# EAGLE schematic Dash V2 (EAGLE 6.4)
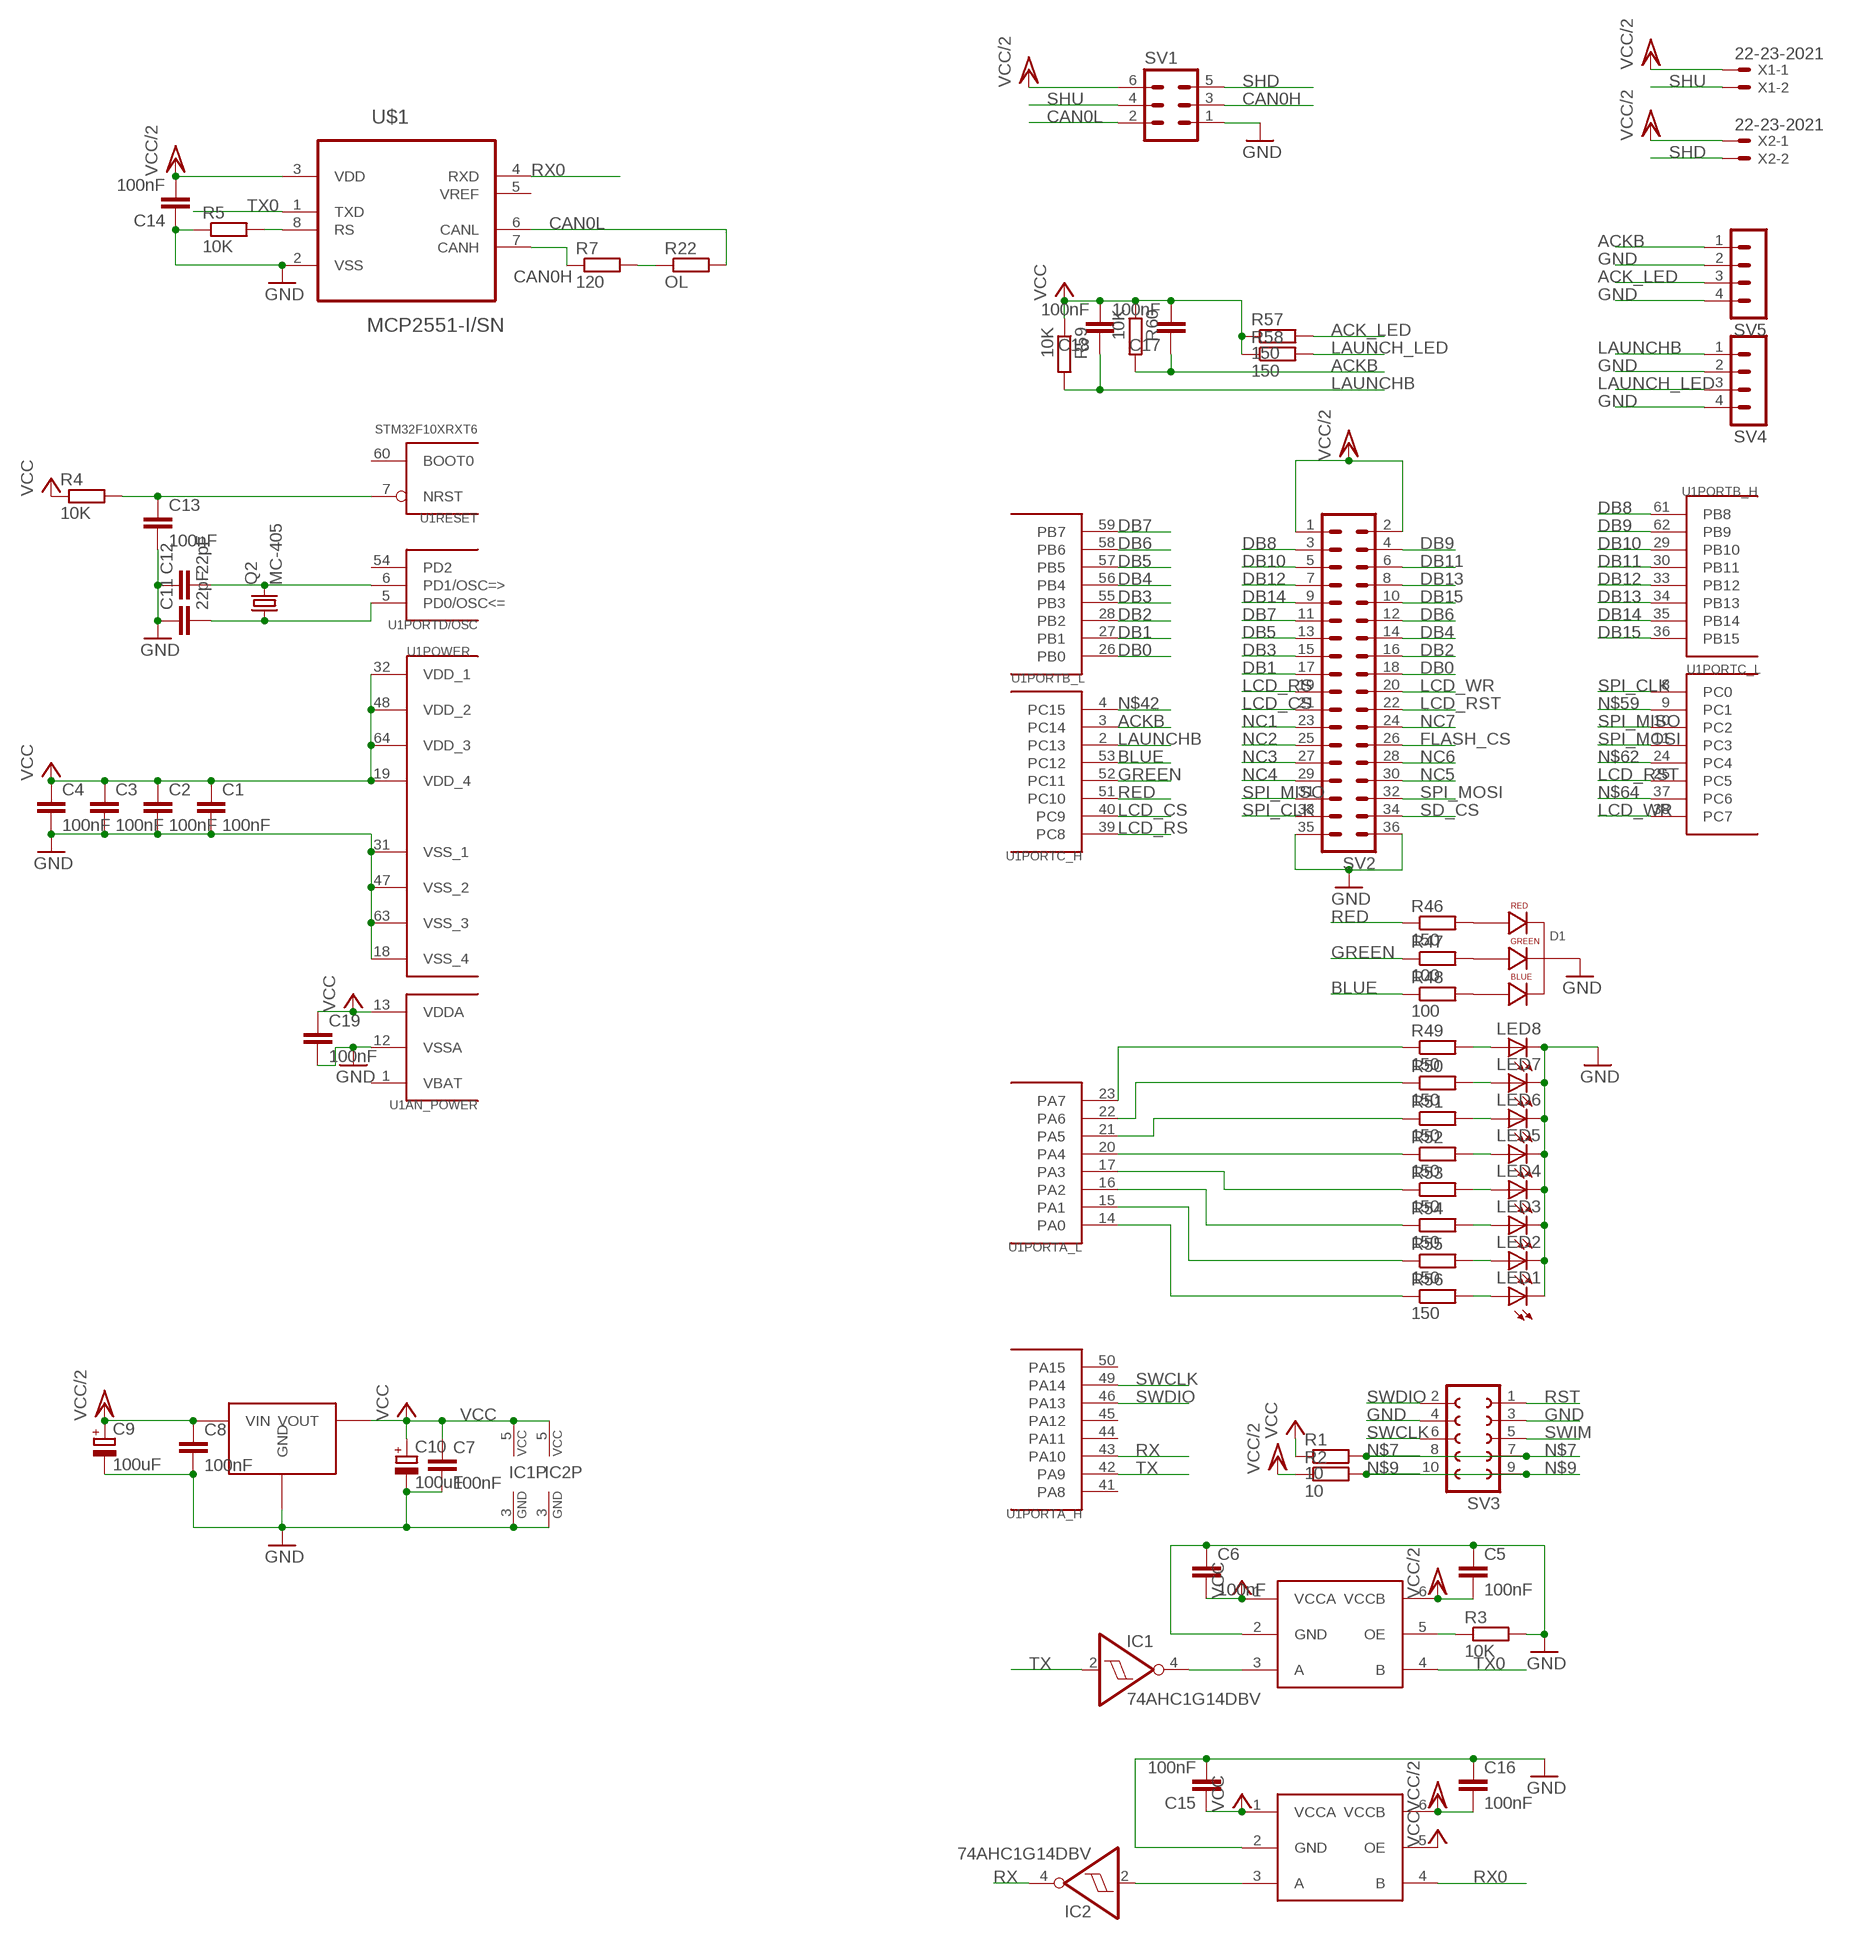
[diagram p0: schematic, sheet 1]

## Parts
C1  100nF  C-EUC0805  [C0805]
C2  100nF  C-EUC0805  [C0805]
C3  100nF  C-EUC0805  [C0805]
C4  100nF  C-EUC0805  [C0805]
C5  100nF  C-EUC0805  [C0805]
C6  100nF  C-EUC0805  [C0805]
C7  100nF  C-EUC0805  [C0805]
C8  100nF  C-EUC0805  [C0805]
C9  100uF  CPOL-EU153CLV-0605  [153CLV-0605]
C10  100uF  CPOL-EU153CLV-0605  [153CLV-0605]
C11  22pF  C-EUC0805  [C0805]
C12  22pF  C-EUC0805  [C0805]
C13  100nF  C-EUC0805  [C0805]
C14  100nF  C-EUC0805  [C0805]
C15  100nF  C-EUC0805  [C0805]
C16  100nF  C-EUC0805  [C0805]
C17  100nF  C-EUC0805  [C0805]
C18  100nF  C-EUC0805  [C0805]
C19  100nF  C-EUC0805  [C0805]
D1  LED-RGB-CC-THRUDIFFUSE  [LED-RGB-THRU]
IC1  74AHC1G14DBV  [SOT23-5]
IC2  74AHC1G14DBV  [SOT23-5]
LED1  LED5MM  [LED5MM]
LED2  LED5MM  [LED5MM]
LED3  LED5MM  [LED5MM]
LED4  LED5MM  [LED5MM]
LED5  LED5MM  [LED5MM]
LED6  LED5MM  [LED5MM]
LED7  LED5MM  [LED5MM]
LED8  LED5MM  [LED5MM]
Q2  MC-405  [MC-405]
R1  10  R-EU_R0805  [R0805]
R2  10  R-EU_R0805  [R0805]
R3  10K  R-EU_R1206  [R1206]
R4  10K  R-EU_R0805  [R0805]
R5  10K  R-EU_R0805  [R0805]
R7  120  R-EU_R0805  [R0805]
R22  OL  R-EU_R0805  [R0805]
R46  150  R-EU_R1206  [R1206]
R47  100  R-EU_R1206  [R1206]
R48  100  R-EU_R1206  [R1206]
R49  150  R-EU_R1206  [R1206]
R50  150  R-EU_R1206  [R1206]
R51  150  R-EU_R1206  [R1206]
R52  150  R-EU_R1206  [R1206]
R53  150  R-EU_R1206  [R1206]
R54  150  R-EU_R1206  [R1206]
R55  150  R-EU_R1206  [R1206]
R56  150  R-EU_R1206  [R1206]
R57  150  R-EU_R1206  [R1206]
R58  150  R-EU_R1206  [R1206]
R59  10K  R-EU_R1206  [R1206]
R60  10K  R-EU_R1206  [R1206]
SV1  MA03-2  [MA03-2]
SV2  MA18-2  [MA18-2]
SV3  FE05-2W  [FE05-2W]
SV4  MA04-1  [MA04-1]
SV5  MA04-1  [MA04-1]
U1  STM32F10XRXT6  [TQFP64]
U$1  MCP2551-I/SN  [SOIC127P600X175-8N]
U$2  TXB0101  [TSOT23-6_DDC]
U$3  TS2940  [TO-252]
U$4  TXB0101  [TSOT23-6_DDC]
X1  22-23-2021  [22-23-2021]
X2  22-23-2021  [22-23-2021]

## Nets
ACK_LED: R57.2 SV5.3
ACKB: C17.1 R60.2 SV5.1 U1.3(PORTC_H:PC14)
BLUE: R48.1 U1.53(PORTC_H:PC12)
CAN0H: R7.1 SV1.3 U$1.7(CANH)
CAN0L: R22.2 SV1.2 U$1.6(CANL)
DB0: SV2.18 U1.26(PORTB_L:PB0)
DB1: SV2.17 U1.27(PORTB_L:PB1)
DB2: SV2.16 U1.28(PORTB_L:PB2)
DB3: SV2.15 U1.55(PORTB_L:PB3)
DB4: SV2.14 U1.56(PORTB_L:PB4)
DB5: SV2.13 U1.57(PORTB_L:PB5)
DB6: SV2.12 U1.58(PORTB_L:PB6)
DB7: SV2.11 U1.59(PORTB_L:PB7)
DB8: SV2.3 U1.61(PORTB_H:PB8)
DB9: SV2.4 U1.62(PORTB_H:PB9)
DB10: SV2.5 U1.29(PORTB_H:PB10)
DB11: SV2.6 U1.30(PORTB_H:PB11)
DB12: SV2.7 U1.33(PORTB_H:PB12)
DB13: SV2.8 U1.34(PORTB_H:PB13)
DB14: SV2.9 U1.35(PORTB_H:PB14)
DB15: SV2.10 U1.36(PORTB_H:PB15)
FLASH_CS: SV2.26
GND: C1.2 C2.2 C3.2 C4.2 C5.1 C6.1 C7.2 C8.2 C9.- C10.- C11.1 C12.1 C13.2 C14.1 C15.2 C16.1 C19.2 D1.2(CATHODE) IC1.3(GND) IC2.3(GND) LED1.K(C) LED2.K(C) LED3.K(C) LED4.K(C) LED5.K(C) LED6.K(C) LED7.K(C) LED8.K(C) R3.2 R5.1 SV1.1 SV2.35 SV2.36 SV3.3 SV3.4 SV4.2 SV4.4 SV5.2 SV5.4 U1.12(AN_POWER:VSSA) U1.18(POWER:VSS_4) U1.31(POWER:VSS_1) U1.47(POWER:VSS_2) U1.63(POWER:VSS_3) U$1.2(VSS) U$2.2(GND) U$3.GND U$4.2(GND)
GREEN: R47.1 U1.52(PORTC_H:PC11)
LAUNCH_LED: R58.2 SV4.3
LAUNCHB: C18.1 R59.2 SV4.1 U1.2(PORTC_H:PC13)
LCD_CS: SV2.21 U1.40(PORTC_H:PC9)
LCD_RS: SV2.19 U1.39(PORTC_H:PC8)
LCD_RST: SV2.22 U1.25(PORTC_L:PC5)
LCD_WR: SV2.20 U1.38(PORTC_L:PC7)
N$1: IC1.4(O) U$2.3(A)
N$2: C11.2 Q2.1 U1.5(PORTD/OSC:PD0/OSC<=)
N$3: C12.2 Q2.2 U1.6(PORTD/OSC:PD1/OSC=>)
N$4: IC2.2(I) U$4.3(A)
N$6: R5.2 U$1.8(RS)
N$7: R1.2 SV3.7 SV3.8
N$8: R7.2 R22.1
N$9: R2.2 SV3.9 SV3.10
N$13: LED1.A R56.2
N$14: LED2.A R55.2
N$15: LED3.A R54.2
N$16: LED4.A R53.2
N$17: LED5.A R52.2
N$18: LED6.A R51.2
N$19: LED7.A R50.2
N$20: LED8.A R49.2
N$21: R49.1 U1.23(PORTA_L:PA7)
N$22: R50.1 U1.22(PORTA_L:PA6)
N$23: R51.1 U1.21(PORTA_L:PA5)
N$24: R52.1 U1.20(PORTA_L:PA4)
N$25: R56.1 U1.14(PORTA_L:PA0)
N$26: R55.1 U1.15(PORTA_L:PA1)
N$27: R54.1 U1.16(PORTA_L:PA2)
N$28: R53.1 U1.17(PORTA_L:PA3)
N$29: D1.1(RED_CATHODE) R46.2
N$30: D1.3(GREEN_CATHODE) R47.2
N$31: D1.4(BLUE_CATHODE) R48.2
N$32: R3.1 U$2.5(OE)
N$42: U1.4(PORTC_H:PC15)
N$59: U1.9(PORTC_L:PC1)
N$62: U1.24(PORTC_L:PC4)
N$64: U1.37(PORTC_L:PC6)
NC1: SV2.23
NC2: SV2.25
NC3: SV2.27
NC4: SV2.29
NC5: SV2.30
NC6: SV2.28
NC7: SV2.24
RED: R46.1 U1.51(PORTC_H:PC10)
RST: C13.1 R4.2 SV3.1 U1.7(RESET:NRST)
RX: IC2.4(O) U1.43(PORTA_H:PA10)
RX0: U$1.4(RXD) U$4.4(B)
SD_CS: SV2.34
SHD: SV1.5 X2.2
SHU: SV1.4 X1.2
SPI_CLK: SV2.33 U1.8(PORTC_L:PC0)
SPI_MISO: SV2.31 U1.10(PORTC_L:PC2)
SPI_MOSI: SV2.32 U1.11(PORTC_L:PC3)
SWCLK: SV3.6 U1.49(PORTA_H:PA14)
SWDIO: SV3.2 U1.46(PORTA_H:PA13)
SWIM: SV3.5
TX: IC1.2(I) U1.42(PORTA_H:PA9)
TX0: U$1.1(TXD) U$2.4(B)
VCC: C1.1 C2.1 C3.1 C4.1 C6.2 C7.1 C10.+ C15.1 C17.2 C18.2 C19.1 IC1.5(VCC) IC2.5(VCC) R1.1 R4.1 R57.1 R58.1 R59.1 R60.1 U1.13(AN_POWER:VDDA) U1.19(POWER:VDD_4) U1.32(POWER:VDD_1) U1.48(POWER:VDD_2) U1.64(POWER:VDD_3) U$2.1(VCCA) U$3.VOUT U$4.1(VCCA) U$4.5(OE)
VCC/2: C5.2 C8.1 C9.+ C14.2 C16.2 R2.1 SV1.6 SV2.1 SV2.2 U$1.3(VDD) U$2.6(VCCB) U$3.VIN U$4.6(VCCB) X1.1 X2.1
Unconnected: U1.41(PORTA_H:PA8) U1.44(PORTA_H:PA11) U1.45(PORTA_H:PA12) U1.50(PORTA_H:PA15) U1.54(PORTD/OSC:PD2) U1.60(RESET:BOOT0) U$1.5(VREF)

## Power pins joined to a net without a drawn wire
VBAT: U1.1(AN_POWER:VBAT)

## Library data of the parts
C1-C8 C11-C19 = rcl:C-EU: CAPACITOR, European symbol
C9 C10 = rcl:CPOL-EU: POLARIZED CAPACITOR, European symbol; FARNELL: 1244406RL
D1 = SparkFun-LED:LED-RGB-CC-THRU: RGB Through-hole common cathode LED SparkFun Storefront: COM-00105 (Clear) COM-09264 (Diffuse); FARNELL: 2290374; PROD_ID: DIO-09434
IC1 IC2 = 74xx-little-de:74*1G14: Single Schmitt-Trigger Inverter Gate; FARNELL: 1893832
LED1-LED8 = led:LED: LED OSRAM: - CHIPLED LG R971, LG N971, LY N971, LG Q971, LY Q971, LO R971, LY R971 LH N974, LH R974 LS Q976, LO Q976, LY Q976 LO Q996 - Hyper CHIPLED LW Q18S LB Q993, LB Q99A, LB R99A - SideLED LS A670, LO A670, LY A670, LG A670, LP A670 LB A673, LV A673, LT A673, LW A673 LH A674 LY A675 LS A676, LA A676, LO A676, LY A676, LW A676 LS A679, LY A679, LG A679 - Hyper Micro SIDELED® LS Y876, LA Y876, LO Y876, LY Y876 LT Y87S - SmartLED LW L88C, LW L88S LB L89C, LB L89S, LG L890 LS L89K, LO L89K, LY L89K LS L896, LA L896, LO L896, LY L896 - TOPLED LS T670, LO T670, LY T670, LG T670, LP T670 LSG T670, LSP T670, LSY T670, LOP T670, LYG T670 LG T671, LOG T671, LSG T671 LB T673, LV T673, LT T673, LW T673 LH T674 LS T676, LA T676, LO T676, LY T676, LB T676, LH T676, LSB T676, LW T676 LB T67C, LV T67C, LT T67C, LS T67K, LO T67K, LY T67K, LW E67C LS E67B, LA E67B, LO E67B, LY E67B, LB E67C, LV E67C, LT E67C LW T67C LS T679, LY T679, LG T679 LS T770, LO T770, LY T770, LG T770, LP T770 LB T773, LV T773, LT T773, LW T773 LH T774 LS E675, LA E675, LY E675, LS T675 LS T776, LA T776, LO T776, LY T776, LB T776 LHGB T686 LT T68C, LB T68C - Hyper Mini TOPLED® LB M676 - Mini TOPLED Santana® LG M470 LS M47K, LO M47K, LY M47K Source: http://www.osram.convergy.de LUXEON: - LUMILED® LXK2-PW12-R00, LXK2-PW12-S00, LXK2-PW14-U00, LXK2-PW14-V00 LXK2-PM12-R00, LXK2-PM12-S00, LXK2-PM14-U00 LXK2-PE12-Q00, LXK2-PE12-R00, LXK2-PE12-S00, LXK2-PE14-T00, LXK2-PE14-U00 LXK2-PB12-K00, LXK2-PB12-L00, LXK2-PB12-M00, LXK2-PB14-N00, LXK2-PB14-P00, LXK2-PB14-Q00 LXK2-PR12-L00, LXK2-PR12-M00, LXK2-PR14-Q00, LXK2-PR14-R00 LXK2-PD12-Q00, LXK2-PD12-R00, LXK2-PD12-S00 LXK2-PH12-R00, LXK2-PH12-S00 LXK2-PL12-P00, LXK2-PL12-Q00, LXK2-PL12-R00 Source: www.luxeon.com KINGBRIGHT: KA-3528ASYC Source: www.kingbright.com
Q2 = crystal:MC-405: kHz RANGE CRYSTAL UNIT SMD Source: MC-306_405_406_E07X.PDF Homepage <http://www.epsontoyocom.co.jp>; OC_FARNELL: 2101329; OC_NEWARK: unknown
R1-R5 R7 R22 R46-R60 = rcl:R-EU_: RESISTOR, European symbol
SV1 = con-lstb:MA03-2: PIN HEADER; OC_FARNELL: unknown; OC_NEWARK: unknown
SV2 = con-lstb:MA18-2: PIN HEADER; OC_FARNELL: unknown; OC_NEWARK: unknown
SV3 = con-lsta:FE05-2W: FEMALE HEADER; OC_FARNELL: unknown; OC_NEWARK: unknown
SV4 SV5 = con-lstb:MA04-1: PIN HEADER; OC_FARNELL: unknown; OC_NEWARK: unknown
U1 = stm32:STM32F10XRXT6: STM32F101/103 64pin LQFP
U$1 = mcp:MCP2551-I/SN: High-Speed CAN Transceiver; MPN: MCP2551-I/SN; OC_FARNELL: 9758569; OC_NEWARK: 69K7604; PACKAGE: SOIC-8; SUPPLIER: Microchip
U$2 U$4 = texas:TXB0101; FARNELL: 2437907
U$3 = LDO:TS2940; FARNELL: 7261390
X1 X2 = con-molex:22-23-2021: .100" (2.54mm) Center Header - 2 Pin; MF: MOLEX; MPN: 22-23-2021; OC_FARNELL: 1462926; OC_NEWARK: 25C3832